# Altium project IRNAS_MOSFET_out.PrjPcb
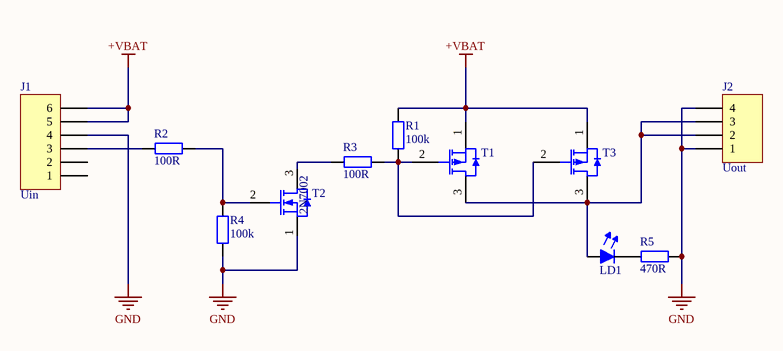
[diagram p0: MOSFET out.SchDoc]
1 sheet, 11 parts. Net scope: global (net labels, ports and power ports of the same name join across sheets).
Board file: MOSFET out.PcbDoc

## Sheet MOSFET out.SchDoc
size A4

### Parts
J1  Uin  [HDR1X6]
J2  Uout  [HDR1X4]
LD1  LED diode  [LED_0603]  (value not drawn)
R1  value 100k  [0603 RES]  (hidden comment: Resistor generic)
R2  value 100R  [0603 RES]  (hidden comment: Resistor generic)
R3  value 100R  [0603 RES]  (hidden comment: Resistor generic)
R4  value 100k  [0603 RES]  (hidden comment: Resistor generic)
R5  value 470R  [0603 RES]  (hidden comment: Resistor generic)
T1  MOSFET-P  [TDSON-8]  (value not drawn)
T2  value 2N7002  [SOT23]  (hidden comment: MOSFET-N)
T3  MOSFET-P  [TDSON-8]  (value not drawn)

### Nets
+VBAT: J1.5 J1.6 R1.2 T1.1(D) T3.1(D)
GND: J1.4 J2.1 J2.4 R4.2 R5.1 T2.1(S)
NetJ1_3: J1.3 R2.2
NetJ2_2: J2.2 J2.3 LD1.1(A1) T1.3(S) T3.3(S)
NetLD1_2: LD1.2(K) R5.2
NetR1_1: R1.1 R3.1 T1.2(G) T3.2(G)
NetR2_1: R2.1 R4.1 T2.2(G)
NetR3_2: R3.2 T2.3(D)

Not connected (* = marked no-connect by the designer): J1 1 2

### Library data of the parts
J1 = Header 6: Header, 6-Pin; LatestRevisionDate: 17-Jul-2002; LatestRevisionNote: Re-released for DXP Platform.; Publisher: Altium Limited
J2 = Header 4: Header, 4-Pin; LatestRevisionDate: 17-Jul-2002; LatestRevisionNote: Re-released for DXP Platform.; Publisher: Altium Limited
LD1 = LED diode: LED blue; Value: LER_Blue_0603
R1-R5 = Resistor: Resistor SMD
T1 T3 = MOSFET-P: MOSFET P; Voltage: -30V; Current: -40A; Value: BSZ120P03NS3GATMA1
  T1: Farnell: 2432709; Farnell 1: 2709895
T2 = MOSFET-N: MOSFET N; pin to pad: 1>2 2>1; Voltage: 20V; Current: 2,5A